# EasyEDA schematic SCH_uCompute_Robot_2026-03-14.json
TITLE: uCompute Rover Module; REV: 1.0; Date: 2026-03-02; Sheet: 1/1; Drawn By: JP; Company: Your Company
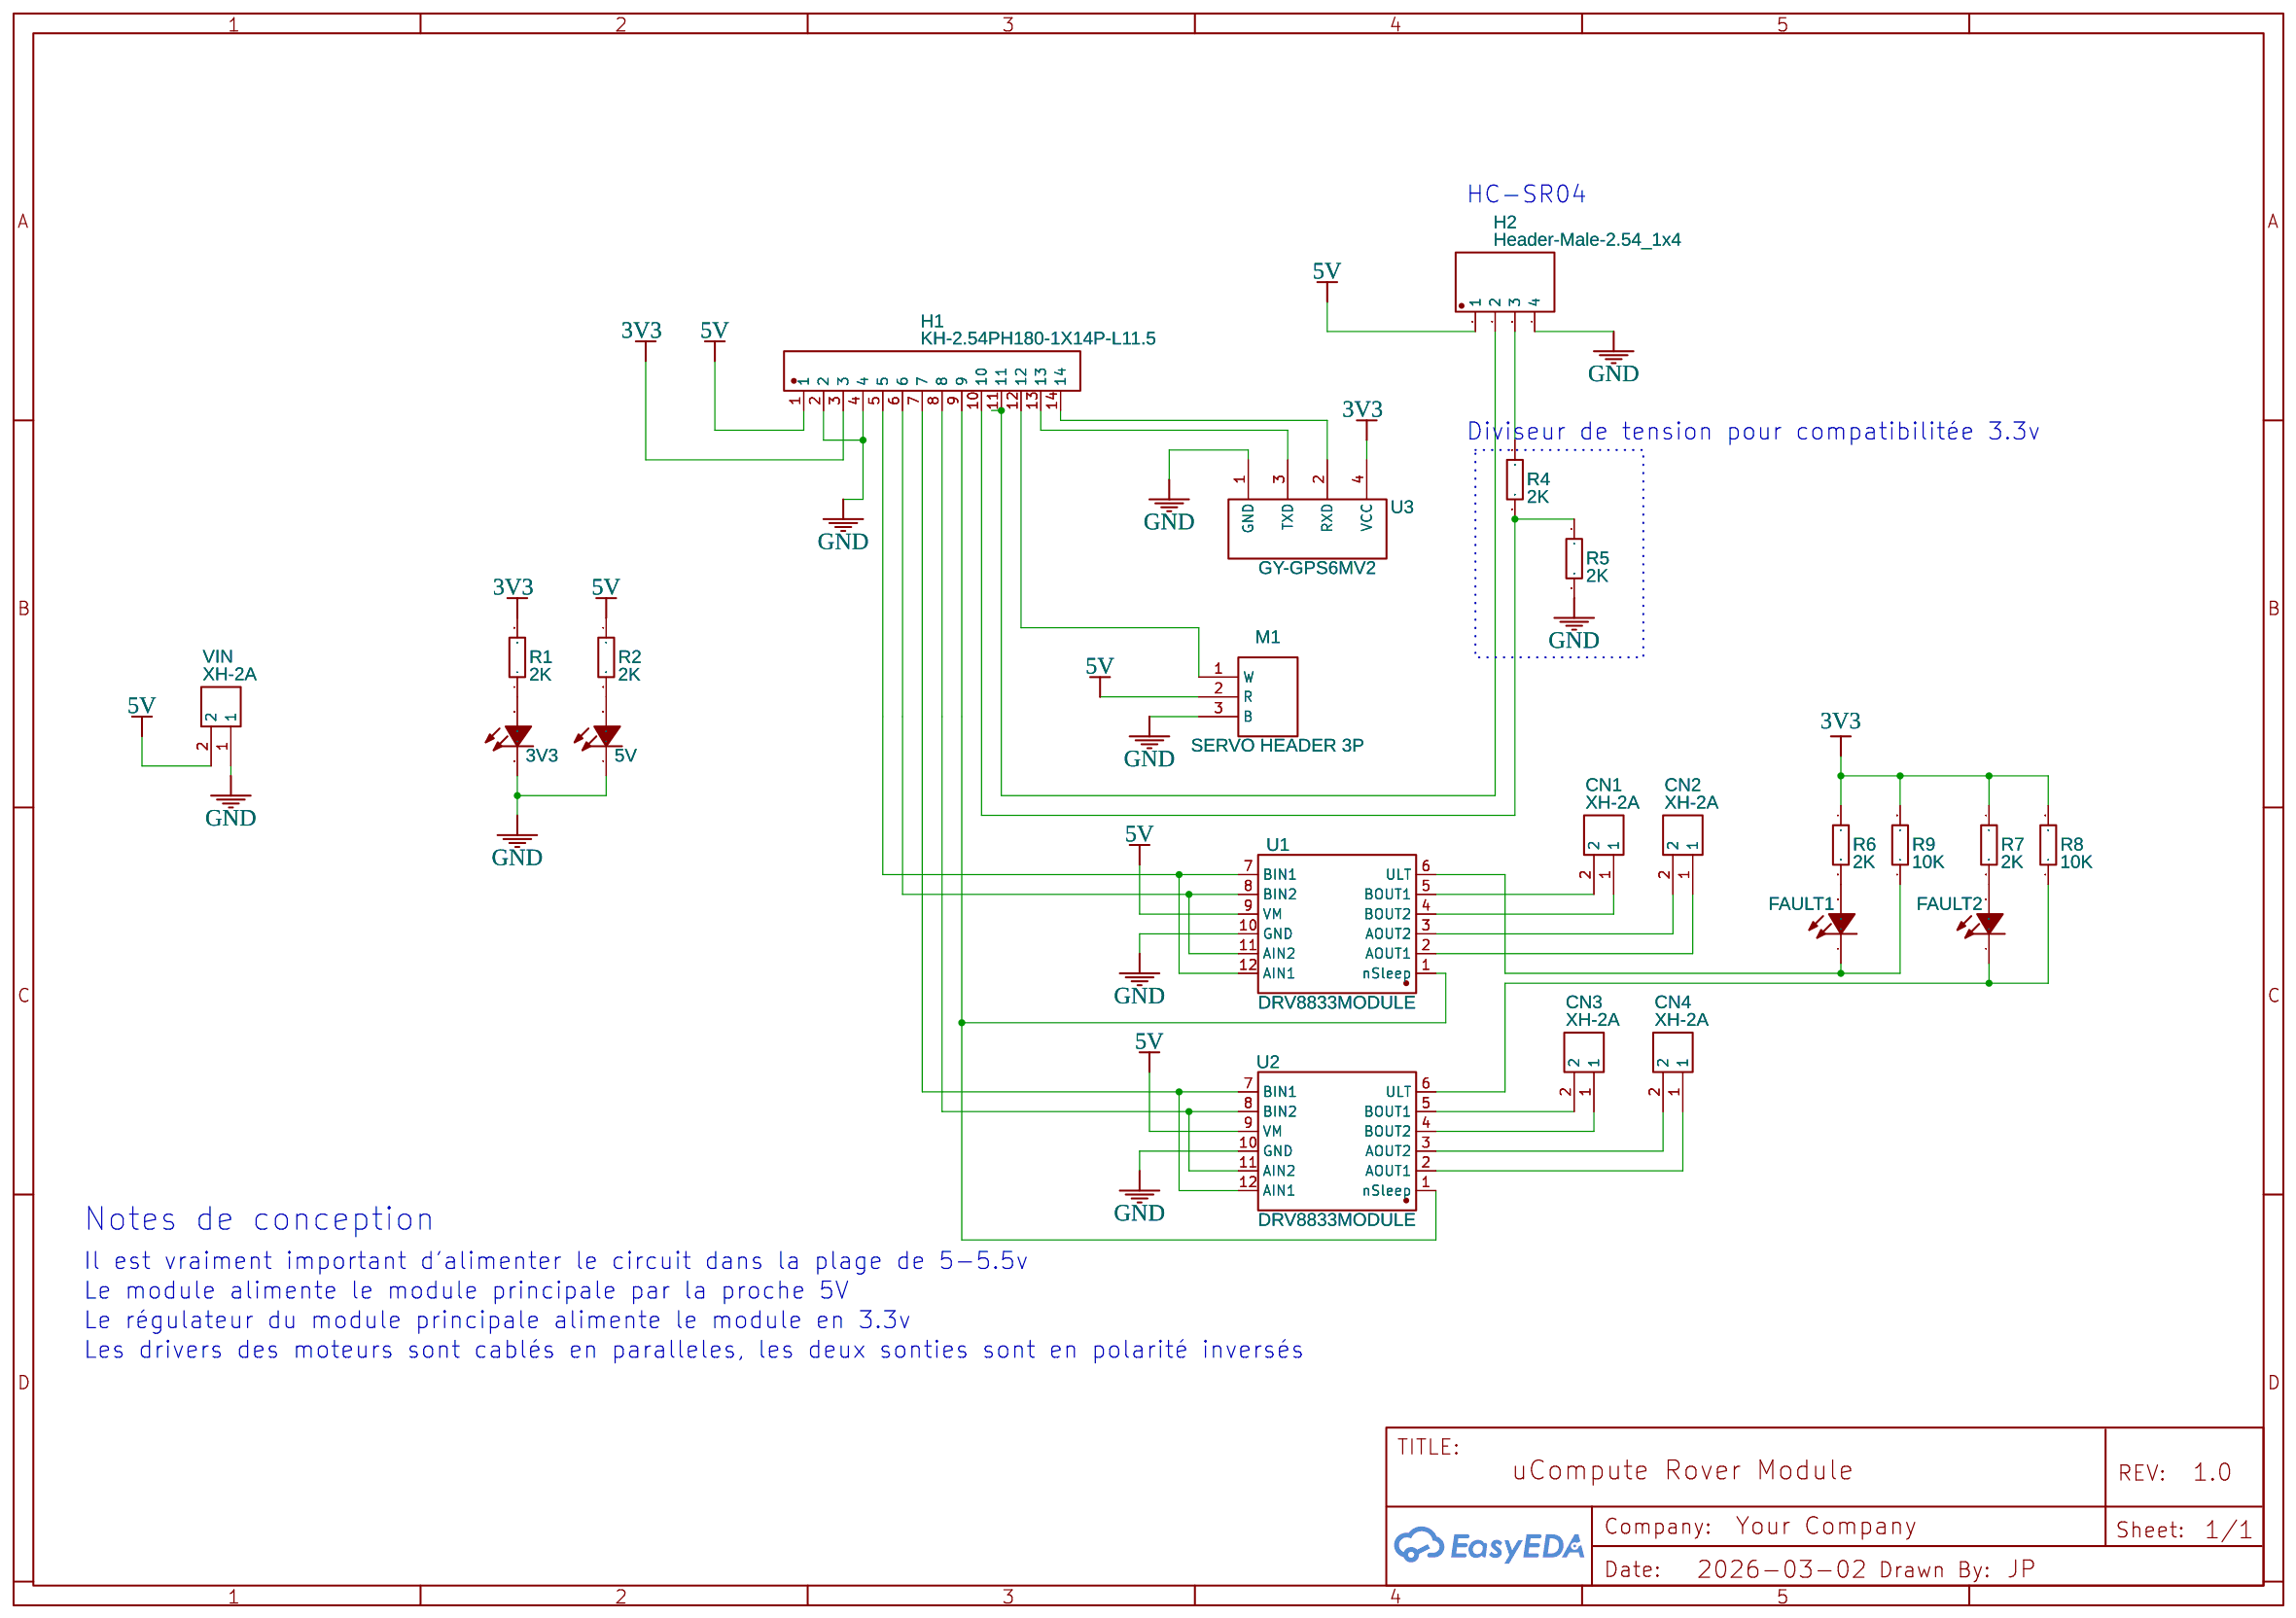
[diagram p0: schematic sheet]

## Parts
3V3  XL-1206QPC  [LED0805-RD_GREEN]
5V  XL-1206QPC  [LED0805-RD_BLUE]
CN1  XH-2A  [CONN-TH_XH-2A]
CN2  XH-2A  [CONN-TH_XH-2A]
CN3  XH-2A  [CONN-TH_XH-2A]
CN4  XH-2A  [CONN-TH_XH-2A]
FAULT1  XL-1206QPC  [LED0805-RD_BLUE]
FAULT2  XL-1206QPC  [LED0805-RD_BLUE]
H1  KH-2.54PH180-1X14P-L11.5  [HDR-TH_14P-P2.54-V-M]
H2  Header-Male-2.54_1x4  [HDR-TH_4P-P2.54-V-M]
M1  SERVO HEADER 3P  [SERVO]
R1  2K  [R0805]
R2  2K  [R0805]
R4  2K  [R0805]
R5  2K  [R0805]
R6  2K  [R0805]
R7  2K  [R0805]
R8  10K  [R0805]
R9  10K  [R0805]
U1  DRV8833MODULE  [DRV8833MODULE]
U2  DRV8833MODULE  [DRV8833MODULE]
U3  GY-GPS6MV2  [GY-GPS6MV2]
VIN  XH-2A  [CONN-TH_XH-2A]

## Library data of the parts
3V3 5V FAULT1 FAULT2 = XL-1206QPC: Supplier: LCSC; Manufacturer: LCSC; Supplier Part: C10781; JLCPCB Part Class: Extended Part; Package Display: No
CN1-CN4 VIN = XH-2A: Supplier: LCSC; Manufacturer: BOOMELE(博穆精密); Supplier Part: C20079; JLCPCB Part Class: Extended Part
H1 = KH-2.54PH180-1X14P-L11.5: Contributor: LCSC; Supplier: LCSC; Supplier Part: C2905490; Manufacturer: kinghelm(金航标); JLCPCB Part Class: Extended Part
H2 = Header-Male-2.54_1x4: Contributor: LCSC; Supplier: LCSC; Manufacturer: Ckmtw(灿科盟); Manufacturer Part: B-2100S04P-A110; Supplier Part: C124378; JLCPCB Part Class: Extended Part
M1 = SERVO HEADER 3P: Manufacturer Part: New SchematicLib; Contributor: joseph Gilson
R1 R2 R4-R9 = RC0805DR-071KL: Supplier: LCSC; Manufacturer: YAGEO(国巨); Contributor: LCSC; Supplier Part: C100051; JLCPCB Part Class: Extended Part; Resistance: 1kΩ
U1 U2 = DRV8833MODULE: Supplier: LCSC; Supplier Part: C544801; Manufacturer: TI(德州仪器); Manufacturer Part: DRV8833PWR; Contributor: obalicoco2
U3 = GY-GPS6MV2: Contributor: JO; Type: GPS

## Nets
3V3: H1.3 R1.2 R6.1 R7.1 R8.2 R9.2 U3.4(VCC)
5V: H1.1 H2.1 M1.2(R) R2.1 U1.9(VM) U2.9(VM) VIN.2
GND: 3V3.1(K) 5V.1(K) H1.2 H1.4 H2.4 M1.3(B) R5.2 U1.10(GND) U2.10(GND) U3.1(GND) VIN.1
Net-(3V3-2): 3V3.2(A) R1.1
Net-(5V-2): 5V.2(A) R2.2
Net-(CN1-1): CN1.1 U1.4(BOUT2)
Net-(CN1-2): CN1.2 U1.5(BOUT1)
Net-(CN2-1): CN2.1 U1.2(AOUT1)
Net-(CN2-2): CN2.2 U1.3(AOUT2)
Net-(CN3-1): CN3.1 U2.4(BOUT2)
Net-(CN3-2): CN3.2 U2.5(BOUT1)
Net-(CN4-1): CN4.1 U2.2(AOUT1)
Net-(CN4-2): CN4.2 U2.3(AOUT2)
Net-(FAULT1-1): FAULT1.1(K) R9.1 U1.6(ULT)
Net-(FAULT1-2): FAULT1.2(A) R6.2
Net-(FAULT2-1): FAULT2.1(K) R8.1 U2.6(ULT)
Net-(FAULT2-2): FAULT2.2(A) R7.2
Net-(H1-5): H1.5 U1.7(BIN1) U1.12(AIN1)
Net-(H1-6): H1.6 U1.8(BIN2) U1.11(AIN2)
Net-(H1-7): H1.7 U2.7(BIN1) U2.12(AIN1)
Net-(H1-8): H1.8 U2.8(BIN2) U2.11(AIN2)
Net-(H1-9): H1.9 U1.1(nSleep) U2.1(nSleep)
Net-(H1-10): H1.10 R4.2 R5.1
Net-(H1-11): H1.11 H2.2
Net-(H1-12): H1.12 M1.1(W)
Net-(H1-13): H1.13 U3.3(TXD)
Net-(H1-14): H1.14 U3.2(RXD)
Net-(H2-3): H2.3 R4.1

## Notes on the sheet
- HC-SR04
- Diviseur de tension pour compatibilitée 3.3v
- Notes de conception
- Il est vraiment important d'alimenter le circuit dans la plage de 5-5.5v
- Le module alimente le module principale par la proche 5V
- Le régulateur du module principale alimente le module en 3.3v
- Les drivers des moteurs sont cablés en paralleles, les deux sonties sont en polarité inversés
